# Altium schematic sheet 4_Current_Sensing.SchDoc: Current Sensing
size A4; DrawnBy: André M. P. Mattos; Engineer: Eng_2_ALT; Revision: V0.0; SheetNumber: 7; SheetTotal: 7
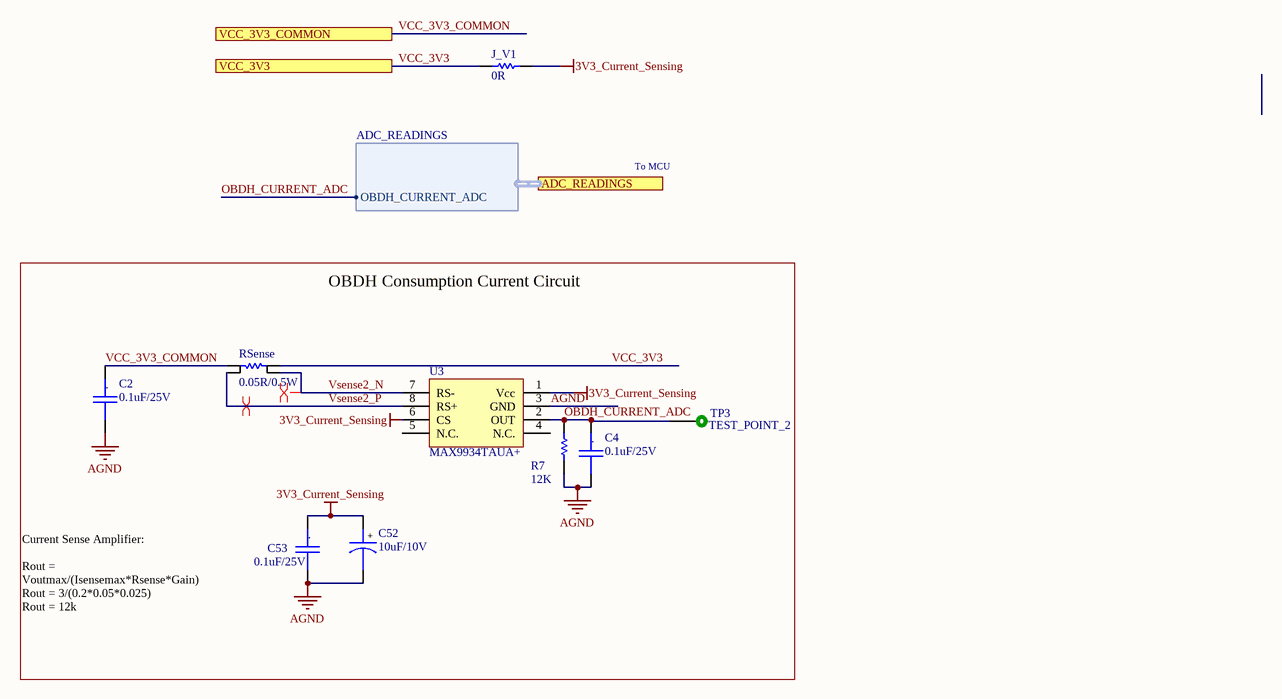
[diagram p0: 4_Current_Sensing.SchDoc]

## Parts
C2  0.1uF/25V  [CC0805]
C4  0.1uF/25V  [CC0805]
C52  10uF/10V  [CC0805_Tantalum]
C53  0.1uF/25V  [CC0805]
J_V1  0R  [0805]
R7  12K  [0805]
RSense  0.05R/0.5W  [1206 - ohmite]
TP3  TEST_POINT_2  [TEST_POINT_2]  (no BOM)
U3  MAX9934TAUA+  [MSOP-8]

## Blocks framed on the sheet
OBDH Consumption Current Circuit: C2 C4 C52 C53 R7 RSense TP3 U3

## Ports
ADC_READINGS (harness ADC_READINGS), VCC_3V3, VCC_3V3_COMMON

## Harnesses
ADC_READINGS: OBDH_CURRENT_ADC

## Nets
3V3_Current_Sensing: C52.1 C53.1 J_V1.1 U3.1(Vcc) U3.6(CS)
AGND: C2.2 C4.2 C52.2 C53.2 R7.1 U3.3(GND)
OBDH_CURRENT_ADC: C4.1 R7.2 TP3.1 U3.2(OUT) ; port ADC_READINGS.OBDH_CURRENT_ADC
VCC_3V3: J_V1.2 RSense.2 ; port VCC_3V3
VCC_3V3_COMMON: C2.1 RSense.1 ; port VCC_3V3_COMMON
Vsense2_N: RSense.4 U3.7(RS-)
Vsense2_P: RSense.3 U3.8(RS+)

Not connected (* = marked no-connect by the designer): U3 4(N.C.) 5(N.C.)

## Layout directives
differential pair: Vsense2_N, Vsense2_P

## Notes on the sheet
- To MCU
- Current Sense Amplifier:
  Rout = Voutmax/(Isensemax*Rsense*Gain)
  Rout = 3/(0.2*0.05*0.025)
  Rout = 12k
- Title
- Size:
- Date:
- A4
- Project:
- Time:
- FloripaSat
- Revision:
- Sheet
- of
- UFSC - SpaceLab
- University Campus - Trindade
- Dep. of Electrical Engineering - CTC
- Florianópolis, Santa Catarina, Brazil
- Drawn By:
- Model:
- CEP: 88040 - 900
- (in symbol Cap_Cer_X7R_0.1uF_25V_0805) .
- (in symbol Cap_Tant_SMD_10uF_10V_0805) +

## Library data of the parts
C2 C4 C53 = Cap_Cer_X7R_0.1uF_25V_0805: CAP CER 0.1UF 25V 10% X7R 0805; Partnumber: CC0805KRX7R8BB104; NCM: 8532.24.10
C52 = Cap_Tant_SMD_10uF_10V_0805: CAP Tantalum 10uF 10V 20% 0805; Partnumber: TPSP106M010R2000; NCM: 8532.21.11
J_V1 = R0R_JUMPER_1/16W_0805: RES 0R OHM 1/16W JUMPER 0805; Partnumber: CRCW08050000Z0EA; NCM: 8533.21.20
R7 = R1.65K_1%_1/10W_0805: RES 1.65K OHM 1/10W 0.1% 0805; Partnumber: PCF0805R-1K65BT1; NCM: 8533.21.20
RSense = R0.05R_0.5%_0.5W_1206: Current Sense Resistors - SMD 0.05ohm .5% 4 Terminal; Partnumber: LVK12R050DER; NCM: 8533.21.20
TP3 = TEST_POINT_2: Test point
U3 = MAX9934TAUA+: Partnumber: MAX9934TAUA+